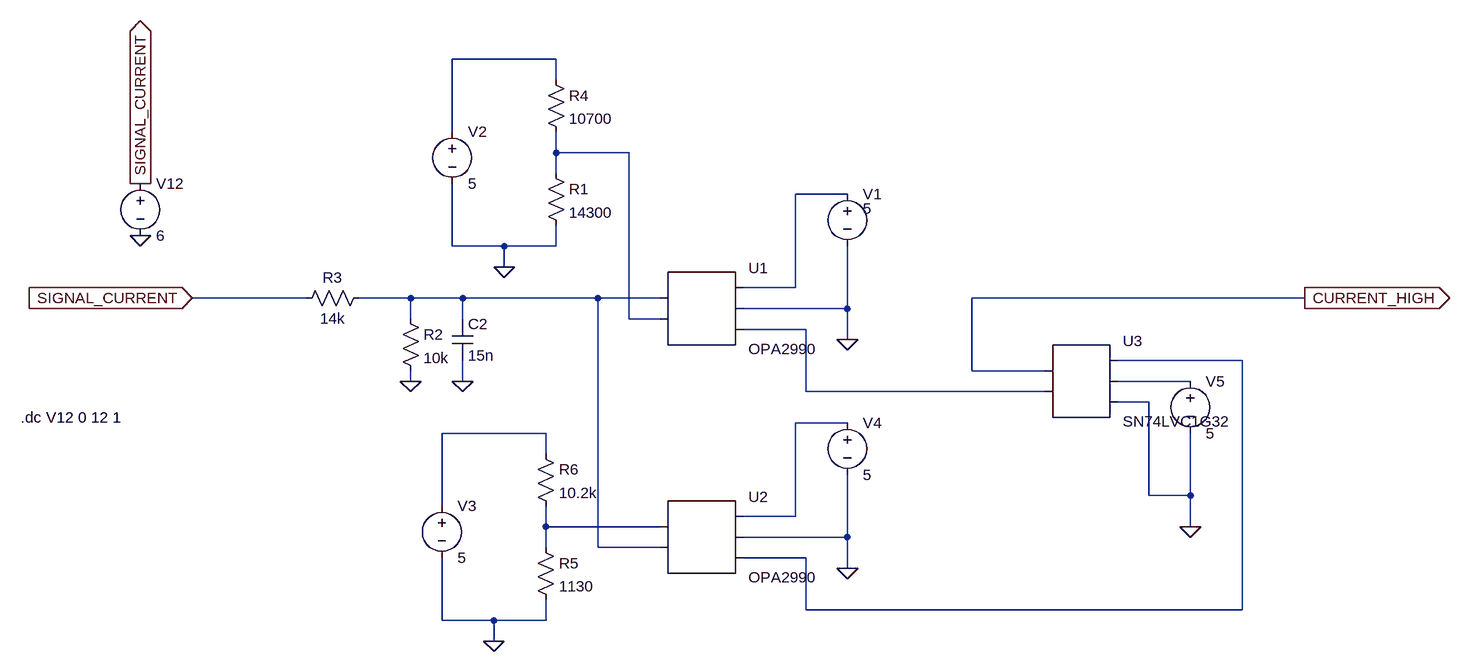
[diagram p0: schematic BSPD_CURRENT.asc]
BSPD_CURRENT.asc, the LTspice schematic file:
Version 4
SHEET 1 1588 1584
WIRE 224 -80 64 -80
WIRE 224 -48 224 -80
WIRE 64 32 64 -80
WIRE 224 64 224 32
WIRE 336 64 224 64
WIRE 224 96 224 64
WIRE 672 128 592 128
WIRE 64 208 64 112
WIRE 144 208 64 208
WIRE 224 208 224 176
WIRE 224 208 144 208
WIRE 144 240 144 208
WIRE 592 272 592 128
WIRE 592 272 512 272
WIRE -160 288 -336 288
WIRE 0 288 -80 288
WIRE 80 288 0 288
WIRE 288 288 80 288
WIRE 384 288 288 288
WIRE 1376 288 864 288
WIRE 672 304 672 208
WIRE 672 304 512 304
WIRE 0 320 0 288
WIRE 80 320 80 288
WIRE 336 320 336 64
WIRE 384 320 336 320
WIRE 608 336 512 336
WIRE 672 352 672 304
WIRE 1280 384 1088 384
WIRE 864 400 864 288
WIRE 976 400 864 400
WIRE 0 416 0 400
WIRE 80 416 80 384
WIRE 1200 416 1088 416
WIRE 608 432 608 336
WIRE 976 432 608 432
WIRE 1136 448 1088 448
WIRE 672 480 592 480
WIRE 208 496 48 496
WIRE 208 528 208 496
WIRE 1136 592 1136 448
WIRE 1200 592 1200 496
WIRE 1200 592 1136 592
WIRE 48 608 48 496
WIRE 592 624 592 480
WIRE 592 624 512 624
WIRE 208 640 208 608
WIRE 384 640 208 640
WIRE 1200 640 1200 592
WIRE 672 656 672 560
WIRE 672 656 512 656
WIRE 208 672 208 640
WIRE 288 672 288 288
WIRE 384 672 288 672
WIRE 608 688 512 688
WIRE 672 704 672 656
WIRE 608 768 608 688
WIRE 1280 768 1280 384
WIRE 1280 768 608 768
WIRE 48 784 48 688
WIRE 128 784 48 784
WIRE 208 784 208 752
WIRE 208 784 128 784
WIRE 128 816 128 784
FLAG 672 352 0
FLAG 80 416 0
FLAG 0 416 0
FLAG 672 704 0
FLAG 1200 640 0
FLAG -336 288 SIGNAL_CURRENT
IOPIN -336 288 In
FLAG 1376 288 CURRENT_HIGH
IOPIN 1376 288 Out
FLAG -416 192 0
FLAG -416 112 SIGNAL_CURRENT
IOPIN -416 112 Out
FLAG 144 240 0
FLAG 128 816 0
SYMBOL AutoGenerated/OPA2990 448 304 R0
SYMATTR InstName U1
SYMBOL voltage 672 112 R0
WINDOW 3 24 38 Left 2
SYMATTR Value 5
SYMATTR InstName V1
SYMBOL res -64 272 R90
WINDOW 0 0 56 VBottom 2
WINDOW 3 32 56 VTop 2
SYMATTR InstName R3
SYMATTR Value 14k
SYMBOL cap 64 320 R0
SYMATTR InstName C2
SYMATTR Value 15n
SYMBOL AutoGenerated/OPA2990 448 656 R0
SYMATTR InstName U2
SYMBOL voltage 672 464 R0
SYMATTR InstName V4
SYMATTR Value 5
SYMBOL AutoGenerated/SN74LVC1G32 1024 416 R0
SYMATTR InstName U3
SYMBOL voltage 1200 400 R0
SYMATTR InstName V5
SYMATTR Value 5
SYMBOL voltage -416 96 R0
SYMATTR InstName V12
SYMATTR Value 6
SYMBOL res -16 304 R0
SYMATTR InstName R2
SYMATTR Value 10k
SYMBOL res 208 80 R0
SYMATTR InstName R1
SYMATTR Value 14300
SYMBOL res 208 -64 R0
SYMATTR InstName R4
SYMATTR Value 10700
SYMBOL voltage 64 16 R0
SYMATTR InstName V2
SYMATTR Value 5
SYMBOL res 192 656 R0
SYMATTR InstName R5
SYMATTR Value 1130
SYMBOL res 192 512 R0
SYMATTR InstName R6
SYMATTR Value 10.2k
SYMBOL voltage 48 592 R0
SYMATTR InstName V3
SYMATTR Value 5
TEXT -600 472 Left 2 !.dc V12 0 12 1

The netlist it stands for:
* BSPD_CURRENT.asc
* U1: OPA2990 (symbol AutoGenerated/OPA2990 not available, pins judged from their places): pin1=N004 pin2=N002 pin3=N003 pin4=0 pin5=N005
V1 N003 0 5
R3 N004 SIGNAL_CURRENT 14k
C2 N004 0 15n
* U2: OPA2990 (symbol AutoGenerated/OPA2990 not available, pins judged from their places): pin1=N010 pin2=N004 pin3=N008 pin4=0 pin5=N006
V4 N008 0 5
* U3: SN74LVC1G32 (symbol AutoGenerated/SN74LVC1G32 not available, pins judged from their places): pin1=CURRENT_HIGH pin2=N005 pin3=N006 pin4=N007 pin5=0
V5 N007 0 5
V12 SIGNAL_CURRENT 0 6
R2 N004 0 10k
R1 N002 0 14300
R4 N001 N002 10700
V2 N001 0 5
R5 N010 0 1130
R6 N009 N010 10.2k
V3 N009 0 5
.dc V12 0 12 1
.backanno
.end